# Altium schematic sheet FTDI_Photosensor.SchDoc
size OrCAD B; SheetNumber: 10; SheetTotal: 11
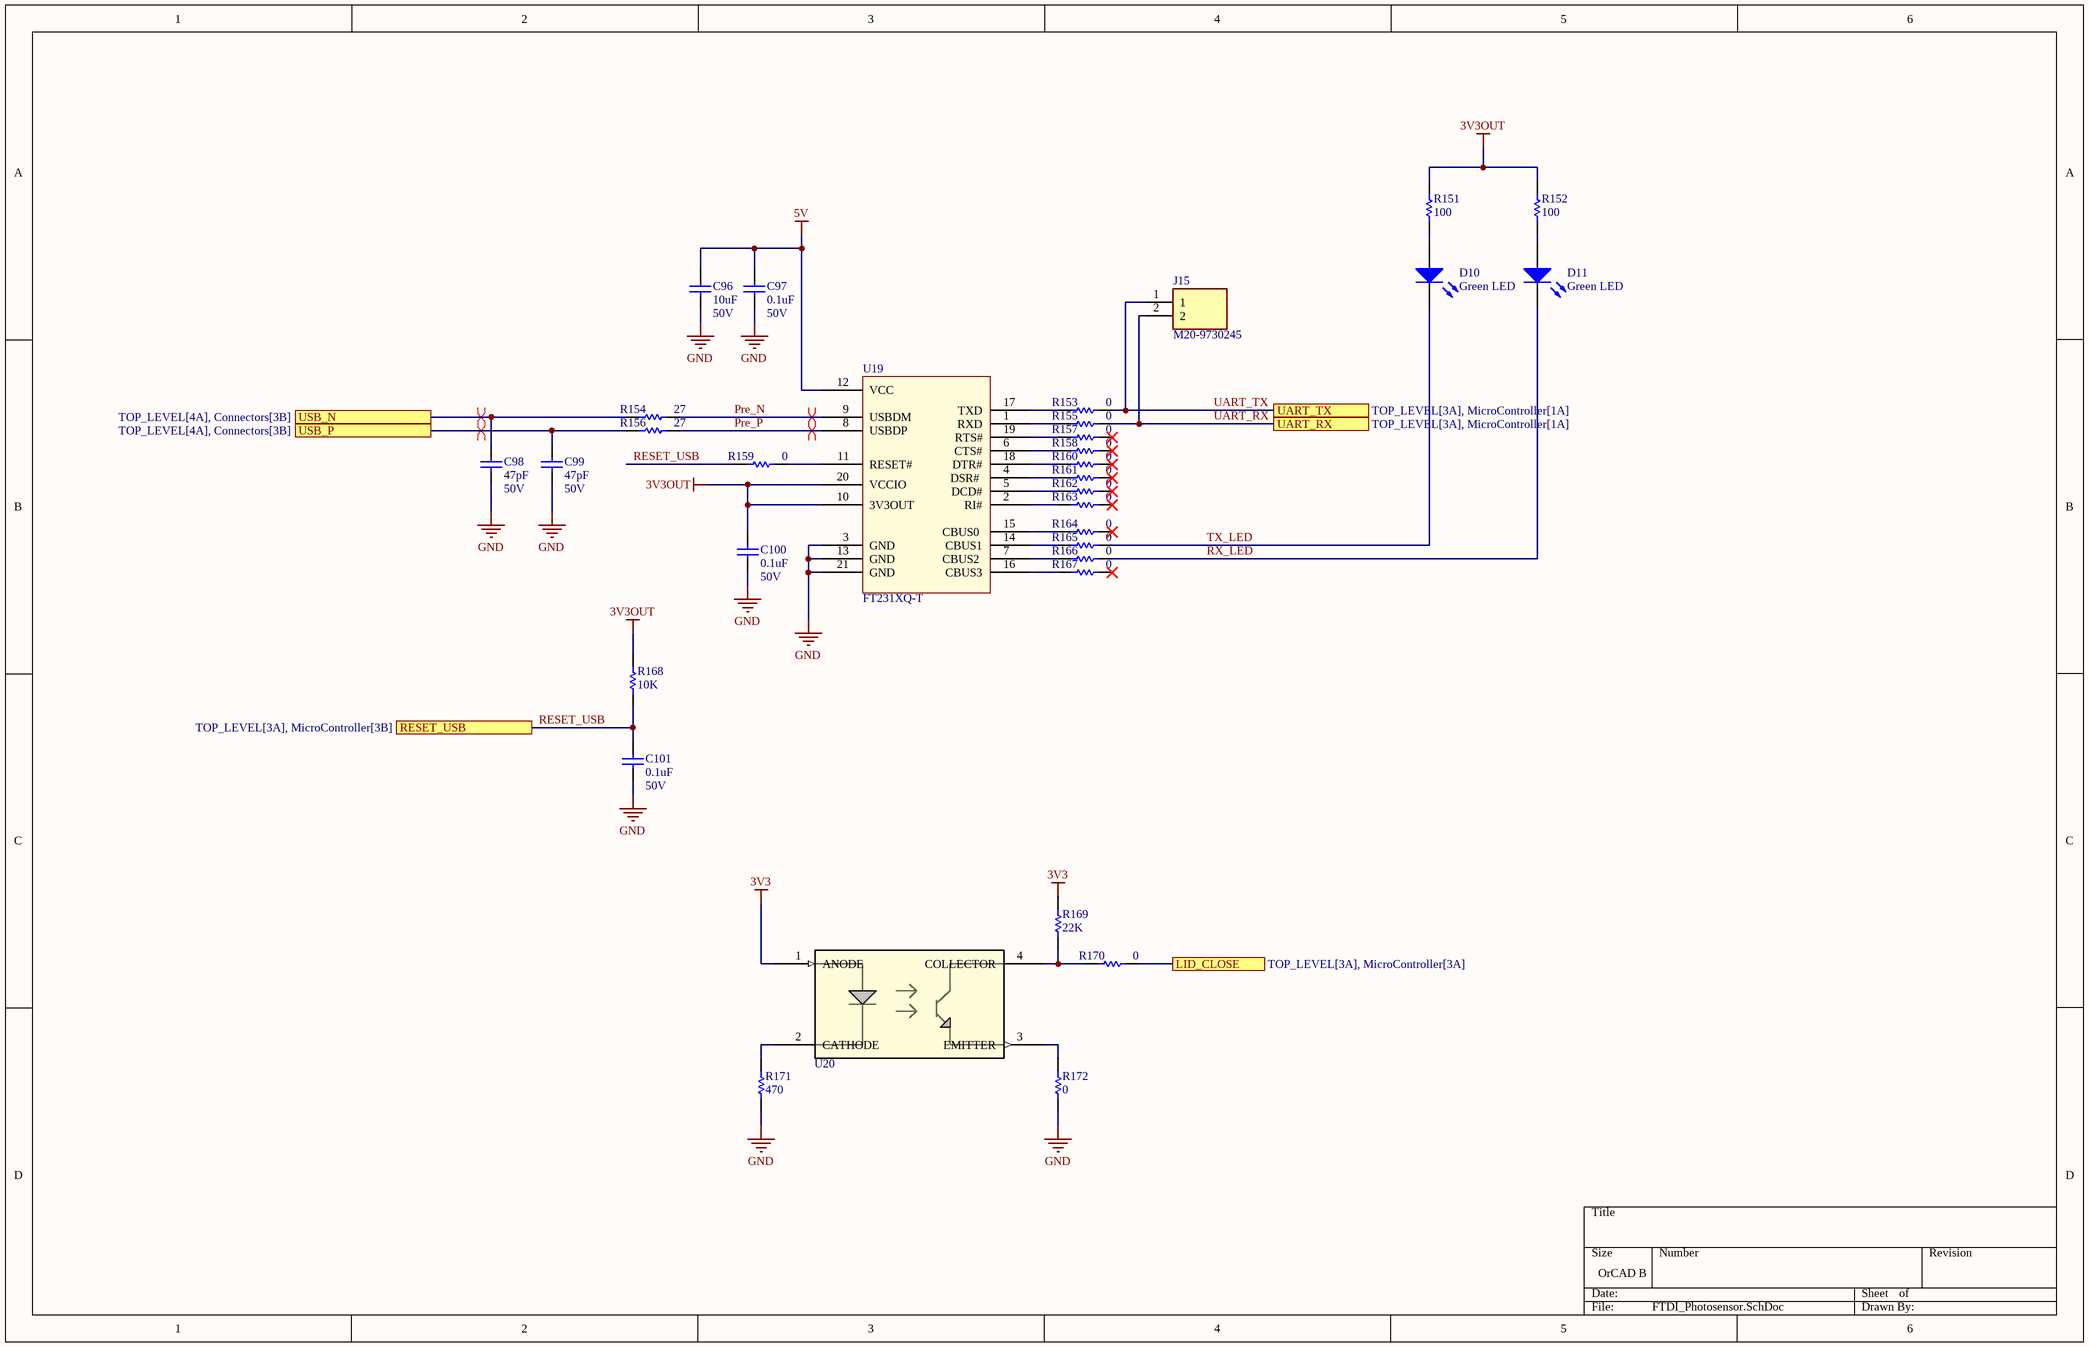
[diagram p0: FTDI_Photosensor.SchDoc]

## Parts
C96  value 10uF  Rating: 50V  [DEFAULT_CAPACITOR_0805]  (hidden comment: GRM21BR61H106KE43L)
C97  value 0.1uF  Rating: 50V  [DEFAULT_CAPACITOR_0805]  (hidden comment: KGM21NR71H104KT)
C98  value 47pF  Rating: 50V  [DEFAULT_CAPACITOR_0805]  (hidden comment: C0805X470J5GACTU)
C99  value 47pF  Rating: 50V  [DEFAULT_CAPACITOR_0805]  (hidden comment: C0805X470J5GACTU)
C100  value 0.1uF  Rating: 50V  [DEFAULT_CAPACITOR_0805]  (hidden comment: KGM21NR71H104KT)
C101  value 0.1uF  Rating: 50V  [DEFAULT_CAPACITOR_0805]  (hidden comment: KGM21NR71H104KT)
D10  value Green LED  [DEFAULT_RESISTOR_0805]  (hidden comment: LSM0805452V)
D11  value Green LED  [DEFAULT_RESISTOR_0805]  (hidden comment: LSM0805452V)
J15  M20-9730245  [M209730245]
R151  value 100  [DEFAULT_RESISTOR_0805]  (hidden comment: CRCW0805100RFKEA)
R152  value 100  [DEFAULT_RESISTOR_0805]  (hidden comment: CRCW0805100RFKEA)
R153  value 0  [DEFAULT_RESISTOR_0805]  (hidden comment: RC0805JR-070RL)
R154  value 27  [DEFAULT_RESISTOR_0805]  (hidden comment: RMCF0805FT27R0)
R155  value 0  [DEFAULT_RESISTOR_0805]  (hidden comment: RC0805JR-070RL)
R156  value 27  [DEFAULT_RESISTOR_0805]  (hidden comment: RMCF0805FT27R0)
R157  value 0  [DEFAULT_RESISTOR_0805]  (hidden comment: RC0805JR-070RL)
R158  value 0  [DEFAULT_RESISTOR_0805]  (hidden comment: RC0805JR-070RL)
R159  value 0  [DEFAULT_RESISTOR_0805]  (hidden comment: RC0805JR-070RL)
R160  value 0  [DEFAULT_RESISTOR_0805]  (hidden comment: RC0805JR-070RL)
R161  value 0  [DEFAULT_RESISTOR_0805]  (hidden comment: RC0805JR-070RL)
R162  value 0  [DEFAULT_RESISTOR_0805]  (hidden comment: RC0805JR-070RL)
R163  value 0  [DEFAULT_RESISTOR_0805]  (hidden comment: RC0805JR-070RL)
R164  value 0  [DEFAULT_RESISTOR_0805]  (hidden comment: RC0805JR-070RL)
R165  value 0  [DEFAULT_RESISTOR_0805]  (hidden comment: RC0805JR-070RL)
R166  value 0  [DEFAULT_RESISTOR_0805]  (hidden comment: RC0805JR-070RL)
R167  value 0  [DEFAULT_RESISTOR_0805]  (hidden comment: RC0805JR-070RL)
R168  value 10K  [DEFAULT_RESISTOR_0805]  (hidden comment: CRCW080510K0FKEA)
R169  value 22K  [DEFAULT_RESISTOR_0805]  (hidden comment: RC0805FR-1322KL)
R170  value 0  [DEFAULT_RESISTOR_0805]  (hidden comment: RC0805JR-070RL)
R171  value 470  [DEFAULT_RESISTOR_0805]  (hidden comment: RC0805FR-07470RL)
R172  value 0  [DEFAULT_RESISTOR_0805]  (hidden comment: RC0805JR-070RL)
U19  FT231XQ-T  [FT231XQ-QFN20]
U20  EE-SX1320  [EE-SX1320_OMR]  (value not drawn)

## Ports
LID_CLOSE (see TOP_LEVEL[3A], MicroController[3A]), RESET_USB (see TOP_LEVEL[3A], MicroController[3B]), UART_RX (see TOP_LEVEL[3A], MicroController[1A]), UART_TX (see TOP_LEVEL[3A], MicroController[1A]), USB_N (see TOP_LEVEL[4A], Connectors[3B]), USB_P (see TOP_LEVEL[4A], Connectors[3B])

## Nets
3V3: R169.1 U20.1(ANODE)
3V3OUT: C100.2 R151.1 R152.1 R168.1 U19.10(3V3OUT) U19.20(VCCIO)
5V: C96.2 C97.2 U19.12(VCC)
GND: C96.1 C97.1 C98.1 C99.1 C100.1 C101.1 R171.2 R172.2 U19.3(GND) U19.13(GND) U19.21(GND)
LID_CLOSE: R170.1 ; port LID_CLOSE
Pre_N: R154.1 U19.9(USBDM)
Pre_P: R156.1 U19.8(USBDP)
RESET_USB: C101.2 R159.2 R168.2 ; port RESET_USB
RX_LED: D11.2(K) R166.1
TX_LED: D10.2(K) R165.1
UART_RX: J15.2 R155.1 ; port UART_RX
UART_TX: J15.1 R153.1 ; port UART_TX
USB_N: C98.2 R154.2 ; port USB_N
USB_P: C99.2 R156.2 ; port USB_P
NetD10_1: D10.1(A) R151.2
NetD11_1: D11.1(A) R152.2
NetR153_2: R153.2 U19.17(TXD)
NetR155_2: R155.2 U19.1(RXD)
NetR157_2: R157.2 U19.19(RTS#)
NetR158_2: R158.2 U19.6(CTS#)
NetR159_1: R159.1 U19.11(RESET#)
NetR160_2: R160.2 U19.18(DTR#)
NetR161_2: R161.2 U19.4(DSR#)
NetR162_2: R162.2 U19.5(DCD#)
NetR163_2: R163.2 U19.2(RI#)
NetR164_2: R164.2 U19.15(CBUS0)
NetR165_2: R165.2 U19.14(CBUS1)
NetR166_2: R166.2 U19.7(CBUS2)
NetR167_2: R167.2 U19.16(CBUS3)
NetR169_2: R169.2 R170.2 U20.4(COLLECTOR)
NetR171_1: R171.1 U20.2(CATHODE)
NetR172_1: R172.1 U20.3(EMITTER)

Not connected (* = marked no-connect by the designer): R157 1*; R158 1*; R160 1*; R161 1*; R162 1*; R163 1*; R164 1*; R167 1*

## Layout directives
differential pair: Pre_N, Pre_P, USB_N, USB_P

## Library data of the parts
C96 = GRM21BR61H106KE43L: CAP CER 10UF 50V X5R 0805; MFR PN: GRM21BR61H106KE43L
C97 C100 C101 = KGM21NR71H104KT: CAP CER 0.1UF 50V X7R 0805; Manufacturer: Cal-Chip Electronics, Inc.; Manufacturer P/N: GMC55X7R226M50NT; MFR PN: KGM21NR71H104KT
C98 C99 = C0805X470J5GACTU: CAP CER 47PF 50V C0G/NP0 0805; MFR PN: C0805X470J5GACTU
D10 D11 = LSM0805452V: LED GREEN; MP: Blue LED 0805; MFR PN: LSM0805452V
J15 = M20-9730245: M20: 2 Pos Plug SIL Straight 3mm THT Connector 7mm pin Gold; Manufacturer_Name: Harwin; Geometry.Height: 9.54mm; Manufacturer_Part_Number: M20-9730245; Mouser Part Number: 855-M20-9730245; Mouser Price/Stock: https://www.mouser.co.uk/ProductDetail/Harwin/M20-9730245?qs=%252Bk6%2F5FB6qrkOd7%252Bh6nj7DA%3D%3D; Arrow Part Number: *; Arrow Price/Stock: *; Datasheet Link: https://content.harwin.com/m/d105a7681d963845/original/DRG-00452-Technical-Drawing-Datasheet-M20-973-pdf.pdf; MFR PN: M20-9730245
R151 R152 = CRCW0805100RFKEA: RES SMD 100 OHM 1% 1/4W 0805; Power: 1/4W; MFR PN: CRCW0805100RFKEA; Tolerance: 1%
R153 R155 R157-R167 R170 R172 = RC0805JR-070RL: RES 0 OHM JUMPER 1/8W 0805; Power: 1/8W; MFR PN: RC0805JR-070RL; Tolerance: *
R154 R156 = RMCF0805FT27R0: RES 27 OHM 1% 1/8W 0805; Power: 1/8W; MFR PN: RMCF0805FT27R0; Tolerance: 1%
R168 = CRCW080510K0FKEA: RES SMD 10K OHM 1% 1/4W 0805; Power: 1/4W; MFR PN: CRCW080510K0FKEA; Tolerance: 1%
R169 = RC0805FR-1322KL: RES 22K OHM 1% 1/8W 0805; Power: 1/8W; MFR PN: RC0805FR-1322KL; Tolerance: 1%
R171 = RC0805FR-07470RL: RES 470 OHM 1% 1/8W 0805; Power: 1/8W; MFR PN: RC0805FR-07470RL; Tolerance: 1%
U19 = FT231XQ-T: IC USB SERIAL FULL UART 20QFN; Manufacturer: FTDI; Manufacturer P/N: FT231XQ-T; MFR PN: FT231XQ-T
U20 = EE-SX1320: Optical Sensor Through-Beam 0.079" (2mm) Phototransistor Module, Connector, Slot Type; Manufacturer_Name: Omron; Copyright: Copyright (C) 2026 Ultra Librarian. All rights reserved.; Manufacturer_Part_Number: EE-SX1320; RefDes: RefDes; Type: Type; MFR PN: EE-SX1320